# Altium schematic sheet power.SchDoc
size A4; SheetNumber: 1; SheetTotal: 3; SPICEModelCacheXGUZSKWJ: <root> / <DocumentId>XGUZSKWJ</DocumentId> / <CacheFrame Number="0"> / <Model Name="cap" Kind="MDL"> / <Text>*Default semiconductor capacitor / .MODEL CAP C()</Text> / </Model> / <Model Name="zener" Kind="MDL"> / <Text>*ZENER / *Default Zener 10V @ 10mA / *Zener Diode Pinout: A,K / .MODEL ZENER D( BV=10 IBV=10E-3 )</Text> / </Model> / <Model Name="fuse" Kind="CKT"> / <Text>.SUBCKT FUSE 1 2 PARAMS: CURRENT=1 RESISTANCE=1m / SW1 1 2 3 0 SMOD OFF / BNLV 3 0 V=(abs(v(1,2))) / .MODEL SMOD SW (VT={(CURRENT*RESISTANCE)} RON=1g ROFF={RESISTANCE}) / .ENDS FUSE</Text> / </Model> / </CacheFrame> / </root>
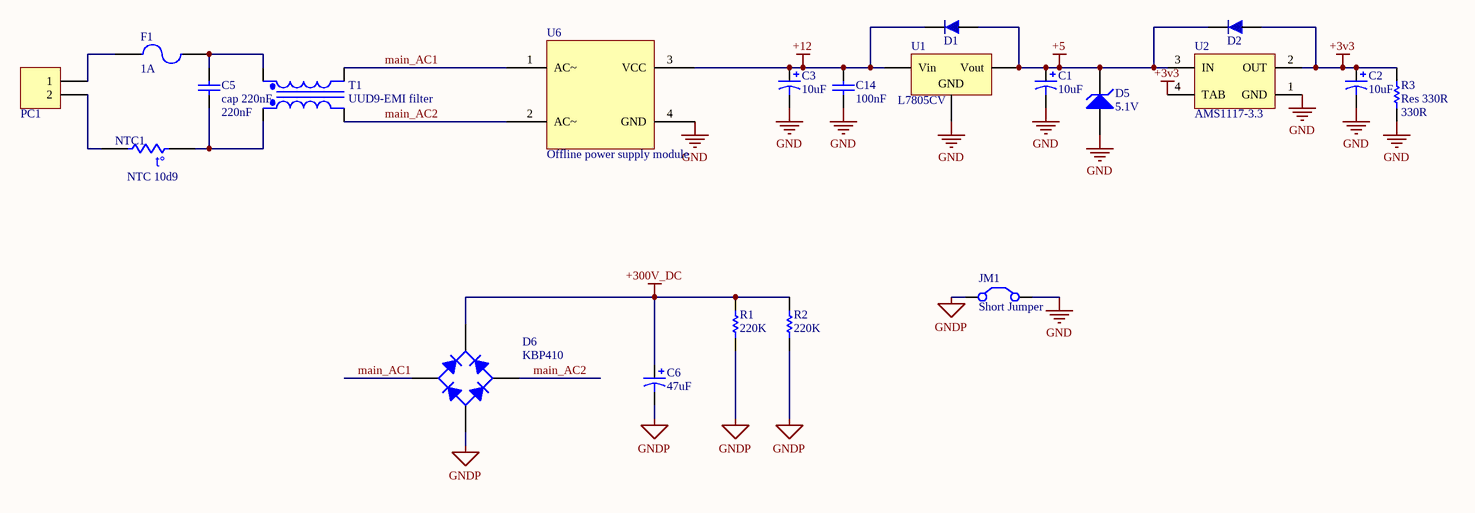
[diagram p0: power.SchDoc]

## Parts
C1  value 10uF  [CAP0805]  (hidden comment: cap 10uF)
C2  value 10uF  [CAP0805]  (hidden comment: cap 10uF)
C3  value 10uF  [CAP0805]  (hidden comment: cap 10uF)
C5  cap 220nF  value 220nF  [MKT-15mm]
C6  value 47uF  [Cap16MM]  (hidden comment: cap 47uF)
C14  value 100nF  [CAP0805]  (hidden comment: cap 100nF)
D1  uf4007  [DIOM4629X24N]  (value not drawn)
D2  uf4007  [DIOM4629X24N]  (value not drawn)
D5  5.1V  [Diode 1n4148 SMD]
D6  KBP410  [Bridge KBL PACKAGE]
F1  1A  [PIN-W2/E2.8]
JM1  Short Jumper  [short_bridge]  (net tie, no BOM)
NTC1  NTC 10d9  [CAPNTO5.08-7.37x3.94]
PC1  Power Connector  [phoenix terminal R 2]  (value not drawn)
R1  value 220K  [RES-(1/2)-Stand]  (hidden comment: Res 220K)
R2  value 220K  [RES-(1/2)-Stand]  (hidden comment: Res 220K)
R3  Res 330R  value 330R  [RES0805]
T1  UUD9-EMI filter  [UUD9.8]
U1  L7805CV  [REG-7805-smd]
U2  AMS1117-3.3  [SOT223]
U6  Offline power supply module  [220AC-12VDC  450mA]

## Nets
+3v3: C2.1 D2.1 R3.2 U2.2(OUT) U2.4(TAB)
+5: C1.1 D1.1 D2.2 D5.2(K) U1.3(Vout) U2.3(IN)
+12: C3.1 C14.1 D1.2 U1.1(Vin) U6.3(VCC)
+300V_DC: C6.1 D6.1(K) R1.2 R2.2
GND: C1.2 C2.2 C3.2 C14.2 D5.1(A) JM1.2 R3.1 U1.2(GND) U2.1(GND) U6.4(GND)
GNDP: C6.2 D6.3(A) JM1.1 R1.1 R2.1
main_AC1: D6.4(C) T1.4(Sec-) U6.1(AC~)
main_AC2: D6.2(C) T1.2(Pri-) U6.2(AC~)
NetC5_1: C5.1 NTC1.1 T1.1(Pri+)
NetC5_2: C5.2 F1.2 T1.3(Sec+)
NetF1_1: F1.1 PC1.1
NetNTC1_2: NTC1.2 PC1.2

## Notes on the sheet
- (in symbol Res Thermal) t°

## Library data of the parts
C1-C3 = Cap Pol1: CAP seramic; Published: 8-Jun-2000; LatestRevisionDate: 17-Jul-2002; LatestRevisionNote: Re-released for DXP Platform.; PackageReference: RB7.6-15; Publisher: Altium Limited; PackageDescription: Polarized Capacitor (Radial); 2 Leads
C5 = Cap: Cap MKT 275V; Published: 8-Jun-2000; LatestRevisionDate: 17-Jul-2002; LatestRevisionNote: Re-released for DXP Platform.; PackageReference: RAD-0.3; Publisher: Altium Limited; PackageDescription: Radial Cap, Thru-Hole; 2 Leads; 0.3 in Pin Spacing
C6 = Cap Pol1: Polarized Capacitor (Radial) 400V; Published: 8-Jun-2000; LatestRevisionDate: 17-Jul-2002; LatestRevisionNote: Re-released for DXP Platform.; PackageReference: RB7.6-15; Publisher: Altium Limited; PackageDescription: Polarized Capacitor (Radial); 2 Leads
C14 = Cap ceramic: CAP seramic
D1 D2 = 1n4007 SMD M7: Standard Rectifiers; Part. No: M7; Manufacturer: DC COMPONENTS; Designer: Abbas Basereh; Link: http://www.tme.eu/en/details/m7/smd-universal-diodes/dc-components/; Link: https://www.aliexpress.com/item/Smd-tube-1n4007-m7-SMA/1213719741.html?spm=2114.01010208.3.1.ZyZ7bC&ws_ab_test=searchweb0_0,searchweb201602_4_10065_10068_10084_10083_10080_10082_10081_10060_10061_10062_10056_10055_10054_10059_10099_10078_10079_427_10073_10103_10102_10096_10052_10050_10051,searchweb201603_4&btsid=db2be5ca-e560-400a-b91c-484ab5ee228b; Data: 16-12-2016
D5 = D Zener: Zener Diode; Published: 8-Jun-2000; LatestRevisionDate: 17-Jul-2002; LatestRevisionNote: Re-released for DXP Platform.; PackageReference: DIODE-0.7; Publisher: Altium Limited; PackageDescription: Diode, Thru-Hole; 2 Leads; 0.7 in Pin Spacing
D6 = Diode Bridge: pin to pad: 3>4 4>3; Company: E.P.I.L; Design Date: 2011/11/02
F1 = Fuse 2: Fuse; Published: 8-Jun-2000; LatestRevisionDate: 17-Jul-2002; LatestRevisionNote: Re-released for DXP Platform.; PackageReference: PIN-W2/E2.8; Publisher: Altium Limited; PackageDescription: Thru-Hole; 2 Leads
JM1 = Solder Jumper: short circuit
NTC1 = Res Thermal: NTC; Published: 24-Mar-1999; LatestRevisionDate: 29-May-2009; LatestRevisionNote: IPC-7351 Footprint Added.; PackageVersion: Mar-2003; PackageReference: 6-0805; Publisher: Altium Limited; PackageDescription: Chip Resistor 0805 Case Size; Code_IPC: RESC2012
PC1 = Power Connector: white Power Connector
R1-R3 = Res1: Resistor; Published: 8-Jun-2000; LatestRevisionDate: 17-Jul-2002; LatestRevisionNote: Re-released for DXP Platform.; PackageReference: AXIAL-0.3; Publisher: Altium Limited; PackageDescription: Axial Device, Thru-Hole; 2 Leads; 0.3 in Pin Spacing
T1 = Trans Cupl: Line filter; Published: 8-Jun-2000; LatestRevisionDate: 17-Jul-2002; LatestRevisionNote: Re-released for DXP Platform.; PackageReference: TRF_4; Publisher: Altium Limited; PackageDescription: Transformer; 4 Leads
U1 = L7805CV-Linear Voltage Regulator IC Positive 1 Output 5V 1.5A TO-220AB: Linear Voltage Regulator IC Positive FIXED; Manufacturer: STMicroelectronics; Designer: Abbas Basereh; Link: https://www.aliexpress.com/item/; Link: http://www.tme.eu/en/; Link: http://www.digikey.com/; Part. No: L7805CV
U2 = AMS1117-x.x: x.x Volt, 800mA Low-Dropout Linear Regulator, 4-pin SOT-223; Designer: Ali Hafizi; Data: 16-12-2016
U6 = Power Supply Module